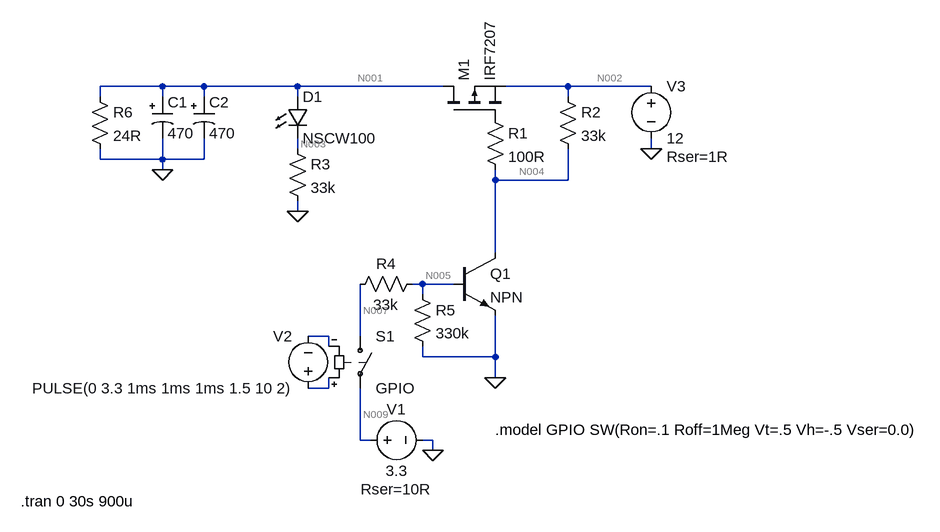
[diagram p0: schematic switch-target-voltage.asc]
switch-target-voltage.asc, the LTspice schematic file:
Version 4
SHEET 1 1112 816
WIRE -256 160 -352 160
WIRE -192 160 -256 160
WIRE -48 160 -192 160
WIRE 176 160 -48 160
WIRE 368 160 272 160
WIRE 496 160 368 160
WIRE -352 176 -352 160
WIRE -256 176 -256 160
WIRE -192 176 -192 160
WIRE -48 176 -48 160
WIRE 368 176 368 160
WIRE -48 256 -48 240
WIRE 496 256 496 240
WIRE -352 272 -352 256
WIRE -256 272 -256 240
WIRE -256 272 -352 272
WIRE -192 272 -192 240
WIRE -192 272 -256 272
WIRE -256 288 -256 272
WIRE 256 304 256 288
WIRE 368 304 368 256
WIRE 368 304 256 304
WIRE -48 352 -48 336
WIRE 256 416 256 304
WIRE 144 464 128 464
WIRE 192 464 144 464
WIRE 144 480 144 464
WIRE 0 544 -32 544
WIRE 48 544 48 464
WIRE 0 560 0 544
WIRE 144 576 144 560
WIRE 256 576 256 512
WIRE 256 576 144 576
WIRE 256 608 256 576
WIRE 0 624 0 608
WIRE 0 624 -32 624
WIRE 48 704 48 624
WIRE 64 704 48 704
WIRE 160 704 144 704
WIRE 160 720 160 704
FLAG -48 352 0
FLAG 496 256 0
FLAG 256 608 0
FLAG 160 720 0
FLAG -256 288 0
SYMBOL pmos 176 208 R270
SYMATTR InstName M1
SYMATTR Value IRF7207
SYMBOL res 240 192 R0
SYMATTR InstName R1
SYMATTR Value 100R
SYMBOL res 352 160 R0
SYMATTR InstName R2
SYMATTR Value 33k
SYMBOL LED -64 176 R0
SYMATTR InstName D1
SYMATTR Value NSCW100
SYMBOL res -64 240 R0
SYMATTR InstName R3
SYMATTR Value 33k
SYMBOL npn 192 416 R0
SYMATTR InstName Q1
SYMBOL res 144 448 R90
WINDOW 0 0 56 VBottom 2
WINDOW 3 32 56 VTop 2
SYMATTR InstName R4
SYMATTR Value 33k
SYMBOL res 128 464 R0
SYMATTR InstName R5
SYMATTR Value 330k
SYMBOL voltage -32 640 R180
WINDOW 0 24 96 Left 2
WINDOW 3 24 16 Left 2
WINDOW 123 0 0 Left 0
WINDOW 39 0 0 Left 0
SYMATTR InstName V2
SYMATTR Value PULSE(0 3.3 1ms 1ms 1ms 1.5 10 2)
SYMBOL voltage 496 144 R0
WINDOW 123 0 0 Left 0
WINDOW 39 24 124 Left 2
SYMATTR InstName V3
SYMATTR Value 12
SYMATTR SpiceLine Rser=1R
SYMBOL voltage 48 704 R270
WINDOW 0 32 56 VTop 2
WINDOW 3 -32 56 VBottom 2
WINDOW 123 0 0 Left 0
WINDOW 39 -60 56 VBottom 2
SYMATTR InstName V1
SYMATTR Value 3.3
SYMATTR SpiceLine Rser=10R
SYMBOL res -368 160 R0
SYMATTR InstName R6
SYMATTR Value 24R
SYMBOL polcap -272 176 R0
SYMATTR InstName C1
SYMATTR Value 470
SYMATTR SpiceLine V=25
SYMBOL polcap -208 176 R0
SYMATTR InstName C2
SYMATTR Value 470
SYMATTR SpiceLine V=25
SYMBOL sw 48 528 R0
SYMATTR InstName S1
SYMATTR Value GPIO
TEXT -474 798 Left 2 !.tran 0 30s 900u
TEXT 256 688 Left 2 !.model GPIO SW(Ron=.1 Roff=1Meg Vt=.5 Vh=-.5 Vser=0.0)

The netlist it stands for:
* switch-target-voltage.asc
M1 N001 P001 N002 N002 IRF7207
R1 P001 N004 100R
R2 N002 N004 33k
D1 N001 N003 NSCW100
R3 N003 0 33k
Q1 N004 N005 0 0 NPN
R4 N005 N007 33k
R5 N005 0 330k
V2 N008 N006 PULSE(0 3.3 1ms 1ms 1ms 1.5 10 2)
V3 N002 0 12 Rser=1R
V1 N009 0 3.3 Rser=10R
R6 N001 0 24R
C1 N001 0 470 V=25
C2 N001 0 470 V=25
S1 N007 N009 N008 N006 GPIO
.model D D
.lib standard.dio
.model NPN NPN
.model PNP PNP
.lib standard.bjt
.model NMOS NMOS
.model PMOS PMOS
.lib standard.mos
.tran 0 30s 900u
.model GPIO SW(Ron=.1 Roff=1Meg Vt=.5 Vh=-.5 Vser=0.0)
.backanno
.end

* Results of the author's LTspice run, read from the files saved beside the schematic
* Operating Point, zero values left out:
*   V(n001) = 11.3 V
*   V(p001) = 10.12 V
*   V(n002) = 11.53 V
*   V(n004) = 10.12 V
*   V(n003) = 8.891 V
*   V(n005) = 692.6 mV
*   V(n007) = 775.9 mV
*   V(n009) = 3.3 V
*   Ic(Q1) = 42.54 µA
*   Ib(Q1) = 425.4 nA
*   Ie(Q1) = -42.97 µA
*   Id(M1) = -471.2 mA
*   Is(M1) = 471.2 mA
*   I(C2) = 5.312 nA
*   I(C1) = 5.312 nA
*   I(D1) = 269.4 µA
*   I(R6) = 470.9 mA
*   I(R5) = 2.099 µA
*   I(R4) = -2.524 µA
*   I(R3) = 269.4 µA
*   I(R2) = 42.54 µA
*   I(S1) = 2.524 µA
*   I(V1) = -2.524 µA
*   I(V3) = -471.2 mA
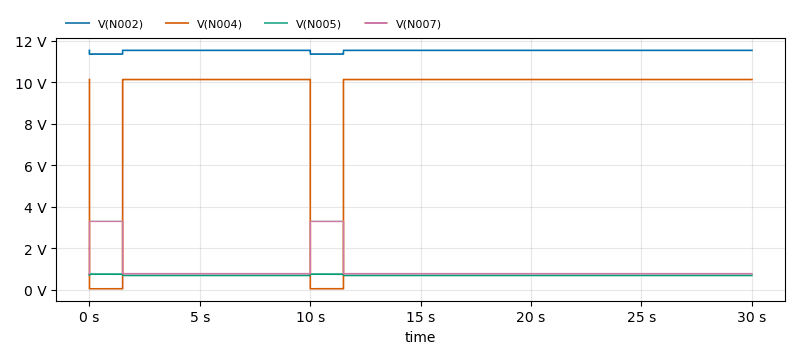
[diagram p1: Transient Analysis of switch-target-voltage.asc, plotted from the saved traces]
* Transient Analysis, 1 run:
*   V(N002): min 11.35 V, max 11.53 V, average 11.51 V, rms 11.51 V, last 11.53 V
*   V(N004): min 49.9 mV, max 10.13 V, average 9.116 V, rms 9.605 V, last 10.13 V
*   V(N005): min 692.6 mV, max 771.6 mV, average 698.9 mV, rms 699.1 mV, last 692.6 mV
*   V(N007): min 775.9 mV, max 3.299 V, average 1.029 V, rms 1.277 V, last 775.9 mV